# Altium schematic sheet 55. SOC PMIC.SchDoc: PMIC (part 2 of 3)
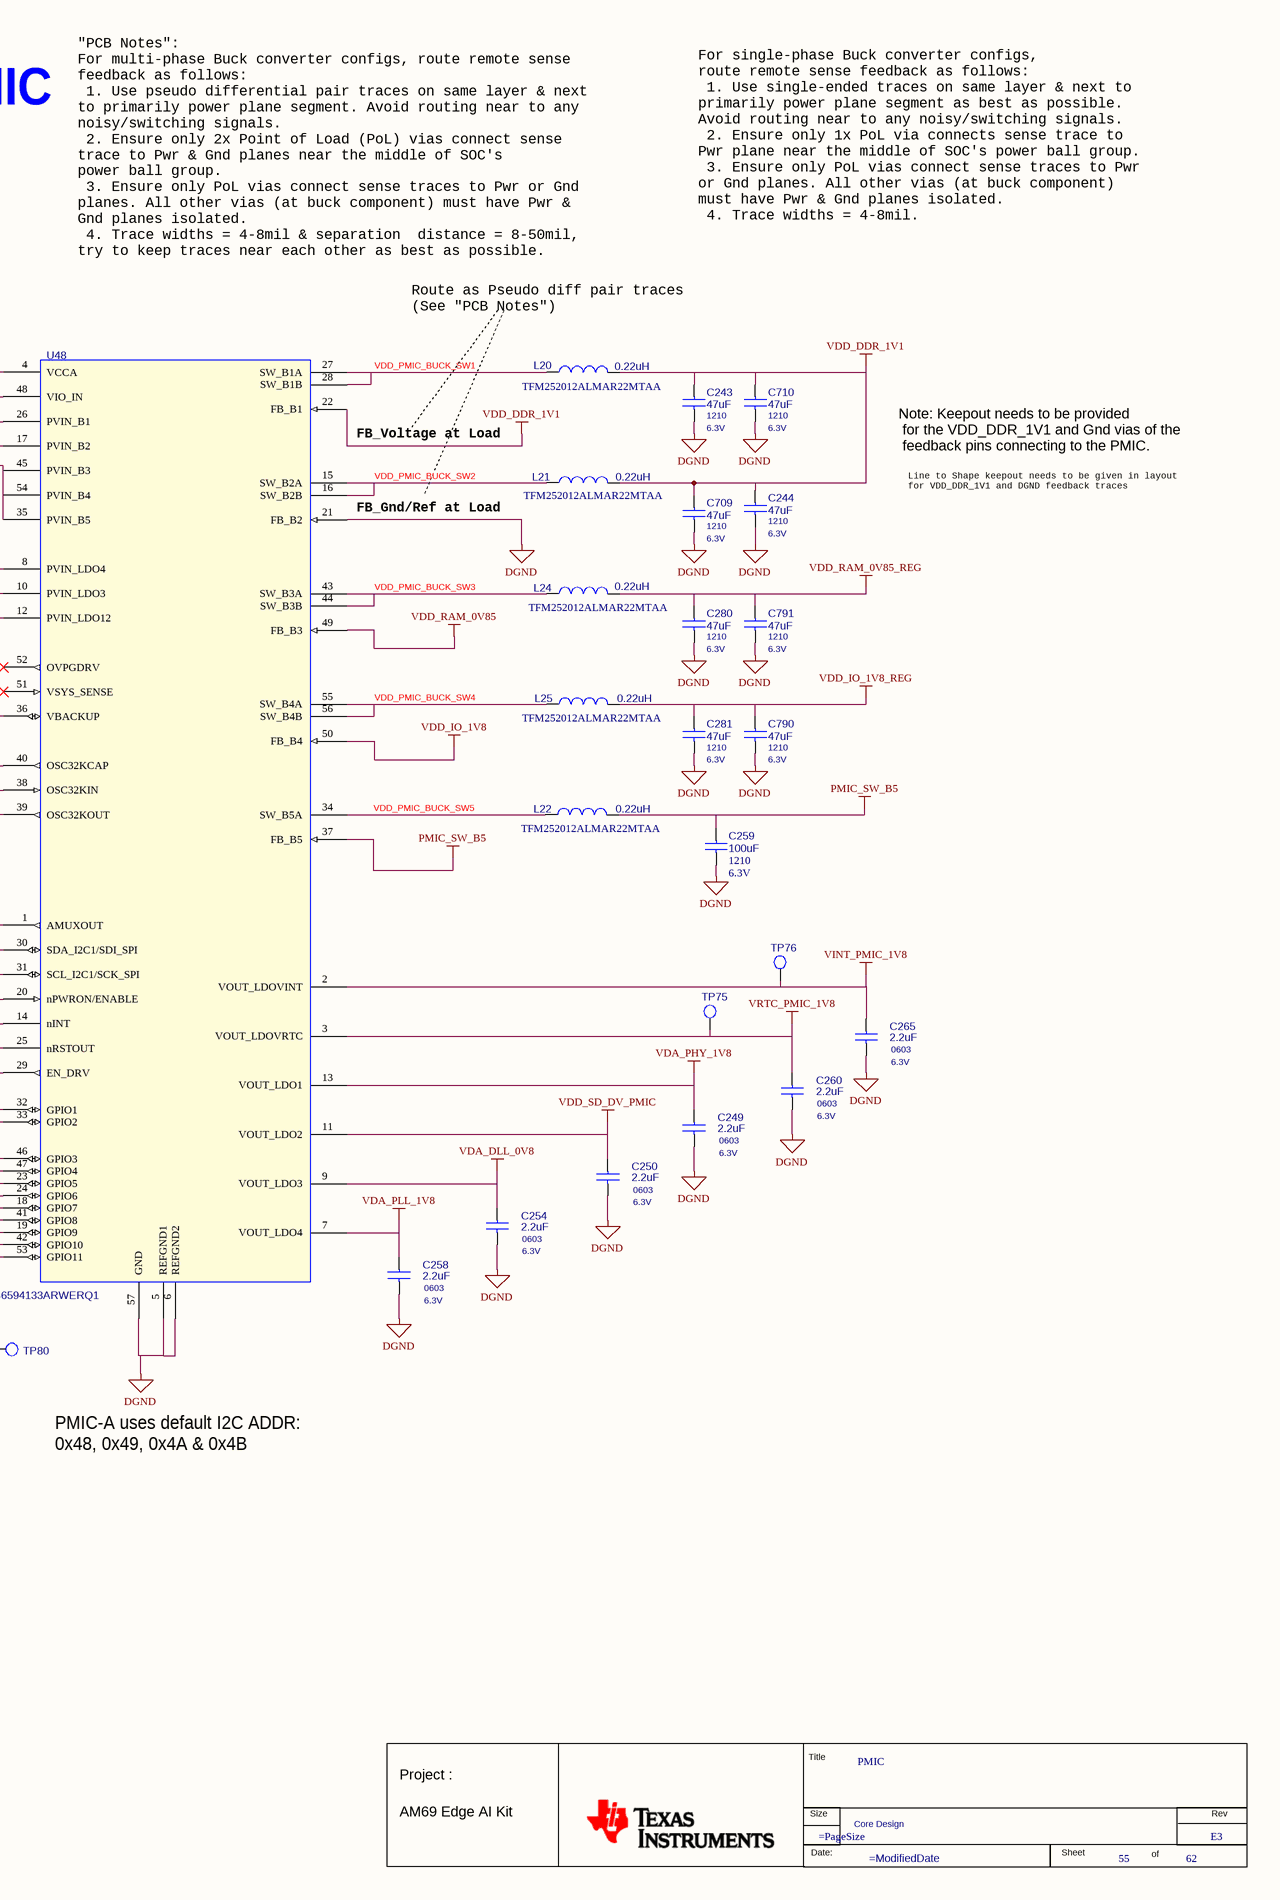
[diagram p2: 55. SOC PMIC.SchDoc, right]
## Library data of the parts
* = MISTRAL_TITLEBLK_CSIZE_1: Issue: 1.0; Project: PROC154E2(001)_SK_AM69; Name: PROC154E2 001 SK AM69; Page Create Date: March  8, 1995; Page Size: =PageSize; Page Modify Date: =ModifiedDate; Schematic Page Count: 62; Schematic Page Number: 55
C243 = CAP_Dup1: CAP CERAMIC 47uF 6.3V 10% X7R AUTO 1210; Part Reference: C243; Automotive Alternate_mfr_part_number: CGA6P1X7S1A476M; Automotive Alternate_mfr_name: TDK; Mistral Part No: 120018090056-R; Mfr_name: MURATA; Mfr_part_number: GCM32ER70J476KE19L; Part_type: CAPACITORS\CERAMIC; Project: TI_J7_SVB-DUT; Wattage: NA; Customs_HS_Code: 85322990; Custom_Duty: 15%; Value: 47uF; PCB Footprint: CAP1210_2-75; Direct Alternate_mfr_part_number: CGA6P1X7S1A476M; Direct Alternate_mfr_name: TDK; Footprint Ref: CAP1210_2-75; Tolerance: 10%; Distributor_name: DIGIKEY; Distributor_part_number: 490-4844-1-ND; Library Ref: CAP; Height: 2.70MM; Weight: 110mg; Temperature: -55°C+125°C; Datasheet: Y:\MIS_DATABASE\DATASHEETS\CAPACITORS\MURATA-GCM-SER.PDF; Crtd /date: ALVY/280918; Chkd/date: MANIRAJA/280918; MECHANICAL 3D STEP FILE: CAP1210_2-75; Library Path: Y:\MIS_DATABASE\Library\ALTIUM_TOOL\SCHEMATICS_PARTS\MS_DISCRETE_Library.schlib; Footprint Path: Y:\MIS_DATABASE\Library\ALTIUM_TOOL\PCB_FOOTPRINTS\Altium_Footprint_Lib.PcbLib; Manufacturer: MURATA
C244 = CAP_Dup1: CAP CERAMIC 47uF 6.3V 10% X7R AUTO 1210; Part Reference: C244; Manufacturer: MURATA; Mistral Part No: 120018090056-R; Mfr_part_number: GCM32ER70J476KE19L; Part_type: CAPACITORS\CERAMIC; Direct Alternate_mfr_name: TDK; Direct Alternate_mfr_part_number: CGA6P1X7S1A476M; Project: TI_J7_SVB-DUT; Wattage: NA; Customs_HS_Code: 85322990; Custom_Duty: 15%; Value: 47uF; PCB Footprint: CAP1210_2-75; Footprint Ref: CAP1210_2-75; Mfr_name: MURATA; Tolerance: 10%; Distributor_name: DIGIKEY; Distributor_part_number: 490-4844-1-ND; Library Ref: CAP; Height: 2.70MM; Weight: 110mg; Temperature: -55°C+125°C; Datasheet: Y:\MIS_DATABASE\DATASHEETS\CAPACITORS\MURATA-GCM-SER.PDF; Crtd /date: ALVY/280918; Chkd/date: MANIRAJA/280918; MECHANICAL 3D STEP FILE: CAP1210_2-75; Library Path: Y:\MIS_DATABASE\Library\ALTIUM_TOOL\SCHEMATICS_PARTS\MS_DISCRETE_Library.schlib; Footprint Path: Y:\MIS_DATABASE\Library\ALTIUM_TOOL\PCB_FOOTPRINTS\Altium_Footprint_Lib.PcbLib; Automotive Alternate_mfr_name: TDK; Automotive Alternate_mfr_part_number: CGA6P1X7S1A476M
C245 = CAP_Dup1: CAP CERAMIC 10uF 16V 10% X5R 0805; Part Reference: C245; Part_type: CAPACITORS\CERAMIC; Mfr_part_number: GRM21BR61C106KE15L; Mfr_name: MURATA; Mistral Part No: 120009030205-R; Direct Alternate_mfr_name: SAMSUNG; Direct Alternate_mfr_part_number: CL21B106KPQNNNE; Automotive Alternate_mfr_part_number: GCM21BR71A106KE22L; Wattage: NA; Custom_Duty: 15%; Customs_HS_Code: 85322990; Project: VOCERA; Value: 10uF; PCB Footprint: CAP0805_1-5; Footprint Path: Y:\MIS_DATABASE\Library\ALTIUM_TOOL\PCB_FOOTPRINTS\Altium_Footprint_Lib.PcbLib; Library Path: Y:\MIS_DATABASE\Library\ALTIUM_TOOL\SCHEMATICS_PARTS\MS_DISCRETE_Library.schlib; MECHANICAL 3D STEP FILE: CAP0805_1-5; Footprint Ref: CAP0805_1-5; Chkd/date: SHREESHAIL/220506; Crtd /date: MAZHAR/150506; Datasheet: Y:\MIS_DATABASE\DATASHEETS\CAPACITORS\MURATA-GXX-SER_NOV17.PDF; Temperature: -55°C+85°C; Weight: 9.5mg; Height: 1.35MM; Library Ref: CAP; Distributor_part_number: 490-3886-1-ND; Distributor_name: DIGIKEY; Tolerance: 10%; Automotive Alternate_mfr_name: MURATA; Manufacturer: MURATA
C246 = CAP_Dup1: CAP CERAMIC 10uF 16V 10% X5R 0805; Part Reference: C246; Manufacturer: MURATA; Automotive Alternate_mfr_part_number: GCM21BR71A106KE22L; Direct Alternate_mfr_part_number: CL21B106KPQNNNE; Direct Alternate_mfr_name: SAMSUNG; Part_type: CAPACITORS\CERAMIC; Mfr_part_number: GRM21BR61C106KE15L; Mistral Part No: 120009030205-R; Custom_Duty: 15%; Customs_HS_Code: 85322990; Project: VOCERA; Wattage: NA; Value: 10uF; PCB Footprint: CAP0805_1-5; Automotive Alternate_mfr_name: MURATA; Chkd/date: SHREESHAIL/220506; Crtd /date: MAZHAR/150506; Datasheet: Y:\MIS_DATABASE\DATASHEETS\CAPACITORS\MURATA-GXX-SER_NOV17.PDF; Temperature: -55°C+85°C; Weight: 9.5mg; Height: 1.35MM; Library Ref: CAP; Distributor_part_number: 490-3886-1-ND; Distributor_name: DIGIKEY; Tolerance: 10%; Mfr_name: MURATA; Footprint Ref: CAP0805_1-5; MECHANICAL 3D STEP FILE: CAP0805_1-5; Library Path: Y:\MIS_DATABASE\Library\ALTIUM_TOOL\SCHEMATICS_PARTS\MS_DISCRETE_Library.schlib; Footprint Path: Y:\MIS_DATABASE\Library\ALTIUM_TOOL\PCB_FOOTPRINTS\Altium_Footprint_Lib.PcbLib
C249 = CAP_Dup1: CAP CERAMIC 2.2uF 6.3V 10% X7R AUTO 0603; Part Reference: C249; Part_type: CAPACITORS\CERAMIC; Mfr_part_number: GCM188R70J225KE22D; Mfr_name: MURATA; Mistral Part No: 120019040009-R; Direct Alternate_mfr_name: TDK; Direct Alternate_mfr_part_number: CGA3E1X7R0J225K080AC; Custom_Duty: 15%; Customs_HS_Code: 85322990; Wattage: NA; Project: J7ES_SOM_DUAL-LEO_PMIC; Value: 2.2uF; Footprint Path: Y:\MIS_DATABASE\Library\ALTIUM_TOOL\PCB_FOOTPRINTS\Altium_Footprint_Lib.PcbLib; Library Path: Y:\MIS_DATABASE\Library\ALTIUM_TOOL\SCHEMATICS_PARTS\MS_DISCRETE_Library.schlib; MECHANICAL 3D STEP FILE: CAP0603_1; Chkd/date: MANIRAJA/050419; Crtd /date: ALVY/050419; Datasheet: Y:\MIS_DATABASE\DATASHEETS\CAPACITORS\GCM188R70J225KE22.PDF; Temperature: -55°C+125°C; Weight: 6.3mg; Height: 0.90MM; Library Ref: CAP; Distributor_part_number: 490-5316-1-ND; Distributor_name: DIGIKEY; Tolerance: 10%; Footprint Ref: CAP0603_1; Automotive Alternate_mfr_name: TDK; Automotive Alternate_mfr_part_number: CGA3E1X7R0J225K080AC; PCB Footprint: CAP0603_1; Manufacturer: MURATA
C250 = CAP_Dup1: CAP CERAMIC 2.2uF 6.3V 10% X7R AUTO 0603; Part Reference: C250; Part_type: CAPACITORS\CERAMIC; Mfr_part_number: GCM188R70J225KE22D; Mfr_name: MURATA; Mistral Part No: 120019040009-R; Direct Alternate_mfr_name: TDK; Direct Alternate_mfr_part_number: CGA3E1X7R0J225K080AC; Custom_Duty: 15%; Customs_HS_Code: 85322990; Wattage: NA; Project: J7ES_SOM_DUAL-LEO_PMIC; Value: 2.2uF; PCB Footprint: CAP0603_1; Footprint Path: Y:\MIS_DATABASE\Library\ALTIUM_TOOL\PCB_FOOTPRINTS\Altium_Footprint_Lib.PcbLib; Library Path: Y:\MIS_DATABASE\Library\ALTIUM_TOOL\SCHEMATICS_PARTS\MS_DISCRETE_Library.schlib; MECHANICAL 3D STEP FILE: CAP0603_1; Chkd/date: MANIRAJA/050419; Crtd /date: ALVY/050419; Datasheet: Y:\MIS_DATABASE\DATASHEETS\CAPACITORS\GCM188R70J225KE22.PDF; Temperature: -55°C+125°C; Weight: 6.3mg; Height: 0.90MM; Library Ref: CAP; Distributor_part_number: 490-5316-1-ND; Distributor_name: DIGIKEY; Tolerance: 10%; Footprint Ref: CAP0603_1; Automotive Alternate_mfr_name: TDK; Automotive Alternate_mfr_part_number: CGA3E1X7R0J225K080AC; Manufacturer: MURATA
C254 = CAP_Dup1: CAP CERAMIC 2.2uF 6.3V 10% X7R AUTO 0603; Part Reference: C254; Part_type: CAPACITORS\CERAMIC; Mfr_part_number: GCM188R70J225KE22D; Mfr_name: MURATA; Mistral Part No: 120019040009-R; Direct Alternate_mfr_name: TDK; Direct Alternate_mfr_part_number: CGA3E1X7R0J225K080AC; Custom_Duty: 15%; Customs_HS_Code: 85322990; Wattage: NA; Project: J7ES_SOM_DUAL-LEO_PMIC; Value: 2.2uF; Footprint Path: Y:\MIS_DATABASE\Library\ALTIUM_TOOL\PCB_FOOTPRINTS\Altium_Footprint_Lib.PcbLib; Library Path: Y:\MIS_DATABASE\Library\ALTIUM_TOOL\SCHEMATICS_PARTS\MS_DISCRETE_Library.schlib; MECHANICAL 3D STEP FILE: CAP0603_1; Chkd/date: MANIRAJA/050419; Crtd /date: ALVY/050419; Datasheet: Y:\MIS_DATABASE\DATASHEETS\CAPACITORS\GCM188R70J225KE22.PDF; Temperature: -55°C+125°C; Weight: 6.3mg; Height: 0.90MM; Library Ref: CAP; Distributor_part_number: 490-5316-1-ND; Distributor_name: DIGIKEY; Tolerance: 10%; Footprint Ref: CAP0603_1; Automotive Alternate_mfr_name: TDK; Automotive Alternate_mfr_part_number: CGA3E1X7R0J225K080AC; PCB Footprint: CAP0603_1; Manufacturer: MURATA
C257 = CAP_Dup1: CAP CERAMIC 10uF 16V 10% X5R 0805; Part Reference: C257; Manufacturer: MURATA; Automotive Alternate_mfr_part_number: GCM21BR71A106KE22L; Direct Alternate_mfr_part_number: CL21B106KPQNNNE; Direct Alternate_mfr_name: SAMSUNG; Part_type: CAPACITORS\CERAMIC; Mfr_part_number: GRM21BR61C106KE15L; Mistral Part No: 120009030205-R; Custom_Duty: 15%; Customs_HS_Code: 85322990; Project: VOCERA; Wattage: NA; Value: 10uF; PCB Footprint: CAP0805_1-5; Automotive Alternate_mfr_name: MURATA; Chkd/date: SHREESHAIL/220506; Crtd /date: MAZHAR/150506; Datasheet: Y:\MIS_DATABASE\DATASHEETS\CAPACITORS\MURATA-GXX-SER_NOV17.PDF; Temperature: -55°C+85°C; Weight: 9.5mg; Height: 1.35MM; Library Ref: CAP; Distributor_part_number: 490-3886-1-ND; Distributor_name: DIGIKEY; Tolerance: 10%; Mfr_name: MURATA; Footprint Ref: CAP0805_1-5; MECHANICAL 3D STEP FILE: CAP0805_1-5; Library Path: Y:\MIS_DATABASE\Library\ALTIUM_TOOL\SCHEMATICS_PARTS\MS_DISCRETE_Library.schlib; Footprint Path: Y:\MIS_DATABASE\Library\ALTIUM_TOOL\PCB_FOOTPRINTS\Altium_Footprint_Lib.PcbLib
C258 = CAP_Dup1: CAP CERAMIC 2.2uF 6.3V 10% X7R AUTO 0603; Part Reference: C258; Part_type: CAPACITORS\CERAMIC; Mfr_part_number: GCM188R70J225KE22D; Mfr_name: MURATA; Mistral Part No: 120019040009-R; Direct Alternate_mfr_name: TDK; Direct Alternate_mfr_part_number: CGA3E1X7R0J225K080AC; Custom_Duty: 15%; Customs_HS_Code: 85322990; Wattage: NA; Project: J7ES_SOM_DUAL-LEO_PMIC; Value: 2.2uF; Footprint Path: Y:\MIS_DATABASE\Library\ALTIUM_TOOL\PCB_FOOTPRINTS\Altium_Footprint_Lib.PcbLib; Library Path: Y:\MIS_DATABASE\Library\ALTIUM_TOOL\SCHEMATICS_PARTS\MS_DISCRETE_Library.schlib; MECHANICAL 3D STEP FILE: CAP0603_1; Chkd/date: MANIRAJA/050419; Crtd /date: ALVY/050419; Datasheet: Y:\MIS_DATABASE\DATASHEETS\CAPACITORS\GCM188R70J225KE22.PDF; Temperature: -55°C+125°C; Weight: 6.3mg; Height: 0.90MM; Library Ref: CAP; Distributor_part_number: 490-5316-1-ND; Distributor_name: DIGIKEY; Tolerance: 10%; Footprint Ref: CAP0603_1; Automotive Alternate_mfr_name: TDK; Automotive Alternate_mfr_part_number: CGA3E1X7R0J225K080AC; PCB Footprint: CAP0603_1; Manufacturer: MURATA
C259 = CAP_Dup1: CAP CERAMIC 100uF 2.5V 20% X7T 1210; Part Reference: C259; Automotive Alternate_mfr_part_number: CGA6P1X7S1A476M; Automotive Alternate_mfr_name: TDK; Part_type: CAPACITORS\CERAMIC; Mfr_part_number: GCM32ED70E107ME36; Mfr_name: MURATA; Mistral Part No: 120009080004-R; Custom_Duty: 15%; Customs_HS_Code: 85322990; Wattage: NA; Project: ALL_DATA_NANO_SOM; Value: 100uF; Direct Alternate_mfr_part_number: CGA6P1X7S1A476M; Direct Alternate_mfr_name: TDK; Footprint Path: Y:\MIS_DATABASE\Library\ALTIUM_TOOL\PCB_FOOTPRINTS\Altium_Footprint_Lib.PcbLib; Library Path: Y:\MIS_DATABASE\Library\ALTIUM_TOOL\SCHEMATICS_PARTS\MS_DISCRETE_Library.schlib; MECHANICAL 3D STEP FILE: CAP1210_2-75; Chkd/date: VASANTHA/291216; Crtd /date: MANIRAJA/291216; Datasheet: Y:\MIS_DATABASE\DATASHEETS\CAPACITORS\MURATA-GXX-SER_NOV17.PDF; Temperature: -55°C+85°C; Weight: 110mg; Height: 2.70MM; Library Ref: CAP; Distributor_part_number: 490-3390-1-ND; Distributor_name: DIGIKEY; Tolerance: 20%; Footprint Ref: CAP1210_2-75; Manufacturer: MURATA; PCB Footprint: CAP1210_2-75
C260 = CAP_Dup1: CAP CERAMIC 2.2uF 6.3V 10% X7R AUTO 0603; Part Reference: C260; Part_type: CAPACITORS\CERAMIC; Mfr_part_number: GCM188R70J225KE22D; Mfr_name: MURATA; Mistral Part No: 120019040009-R; Direct Alternate_mfr_name: TDK; Direct Alternate_mfr_part_number: CGA3E1X7R0J225K080AC; Custom_Duty: 15%; Customs_HS_Code: 85322990; Wattage: NA; Project: J7ES_SOM_DUAL-LEO_PMIC; Value: 2.2uF; PCB Footprint: CAP0603_1; Footprint Path: Y:\MIS_DATABASE\Library\ALTIUM_TOOL\PCB_FOOTPRINTS\Altium_Footprint_Lib.PcbLib; Library Path: Y:\MIS_DATABASE\Library\ALTIUM_TOOL\SCHEMATICS_PARTS\MS_DISCRETE_Library.schlib; MECHANICAL 3D STEP FILE: CAP0603_1; Chkd/date: MANIRAJA/050419; Crtd /date: ALVY/050419; Datasheet: Y:\MIS_DATABASE\DATASHEETS\CAPACITORS\GCM188R70J225KE22.PDF; Temperature: -55°C+125°C; Weight: 6.3mg; Height: 0.90MM; Library Ref: CAP; Distributor_part_number: 490-5316-1-ND; Distributor_name: DIGIKEY; Tolerance: 10%; Footprint Ref: CAP0603_1; Automotive Alternate_mfr_name: TDK; Automotive Alternate_mfr_part_number: CGA3E1X7R0J225K080AC; Manufacturer: MURATA
C265 = CAP_Dup1: CAP CERAMIC 2.2uF 6.3V 10% X7R AUTO 0603; Part Reference: C265; Manufacturer: MURATA; Automotive Alternate_mfr_part_number: CGA3E1X7R0J225K080AC; Automotive Alternate_mfr_name: TDK; Part_type: CAPACITORS\CERAMIC; Mfr_part_number: GCM188R70J225KE22D; Mistral Part No: 120019040009-R; Custom_Duty: 15%; Customs_HS_Code: 85322990; Wattage: NA; Project: J7ES_SOM_DUAL-LEO_PMIC; Value: 2.2uF; PCB Footprint: CAP0603_1; Direct Alternate_mfr_part_number: CGA3E1X7R0J225K080AC; Direct Alternate_mfr_name: TDK; Footprint Path: Y:\MIS_DATABASE\Library\ALTIUM_TOOL\PCB_FOOTPRINTS\Altium_Footprint_Lib.PcbLib; Library Path: Y:\MIS_DATABASE\Library\ALTIUM_TOOL\SCHEMATICS_PARTS\MS_DISCRETE_Library.schlib; MECHANICAL 3D STEP FILE: CAP0603_1; Chkd/date: MANIRAJA/050419; Crtd /date: ALVY/050419; Datasheet: Y:\MIS_DATABASE\DATASHEETS\CAPACITORS\GCM188R70J225KE22.PDF; Temperature: -55°C+125°C; Weight: 6.3mg; Height: 0.90MM; Library Ref: CAP; Distributor_part_number: 490-5316-1-ND; Distributor_name: DIGIKEY; Tolerance: 10%; Mfr_name: MURATA; Footprint Ref: CAP0603_1
C275 = CAP_Dup1: CAP CERAMIC 10uF 16V 10% X5R 0805; Part Reference: C275; Part_type: CAPACITORS\CERAMIC; Mfr_part_number: GRM21BR61C106KE15L; Mfr_name: MURATA; Mistral Part No: 120009030205-R; Direct Alternate_mfr_name: SAMSUNG; Direct Alternate_mfr_part_number: CL21B106KPQNNNE; Automotive Alternate_mfr_part_number: GCM21BR71A106KE22L; Wattage: NA; Custom_Duty: 15%; Customs_HS_Code: 85322990; Project: VOCERA; Value: 10uF; PCB Footprint: CAP0805_1-5; Footprint Path: Y:\MIS_DATABASE\Library\ALTIUM_TOOL\PCB_FOOTPRINTS\Altium_Footprint_Lib.PcbLib; Library Path: Y:\MIS_DATABASE\Library\ALTIUM_TOOL\SCHEMATICS_PARTS\MS_DISCRETE_Library.schlib; MECHANICAL 3D STEP FILE: CAP0805_1-5; Footprint Ref: CAP0805_1-5; Chkd/date: SHREESHAIL/220506; Crtd /date: MAZHAR/150506; Datasheet: Y:\MIS_DATABASE\DATASHEETS\CAPACITORS\MURATA-GXX-SER_NOV17.PDF; Temperature: -55°C+85°C; Weight: 9.5mg; Height: 1.35MM; Library Ref: CAP; Distributor_part_number: 490-3886-1-ND; Distributor_name: DIGIKEY; Tolerance: 10%; Automotive Alternate_mfr_name: MURATA; Manufacturer: MURATA
C276 = CAP_Dup1: CAP CERAMIC 10uF 16V 10% X5R 0805; Part Reference: C276; Mistral Part No: 120009030205-R; Mfr_name: MURATA; Mfr_part_number: GRM21BR61C106KE15L; Part_type: CAPACITORS\CERAMIC; Direct Alternate_mfr_name: SAMSUNG; Direct Alternate_mfr_part_number: CL21B106KPQNNNE; Automotive Alternate_mfr_part_number: GCM21BR71A106KE22L; Wattage: NA; Project: VOCERA; Customs_HS_Code: 85322990; Custom_Duty: 15%; Value: 10uF; PCB Footprint: CAP0805_1-5; Footprint Path: Y:\MIS_DATABASE\Library\ALTIUM_TOOL\PCB_FOOTPRINTS\Altium_Footprint_Lib.PcbLib; Library Path: Y:\MIS_DATABASE\Library\ALTIUM_TOOL\SCHEMATICS_PARTS\MS_DISCRETE_Library.schlib; MECHANICAL 3D STEP FILE: CAP0805_1-5; Footprint Ref: CAP0805_1-5; Tolerance: 10%; Distributor_name: DIGIKEY; Distributor_part_number: 490-3886-1-ND; Library Ref: CAP; Height: 1.35MM; Weight: 9.5mg; Temperature: -55°C+85°C; Datasheet: Y:\MIS_DATABASE\DATASHEETS\CAPACITORS\MURATA-GXX-SER_NOV17.PDF; Crtd /date: MAZHAR/150506; Chkd/date: SHREESHAIL/220506; Automotive Alternate_mfr_name: MURATA; Manufacturer: MURATA
C280 = CAP_Dup1: CAP CERAMIC 47uF 6.3V 10% X7R AUTO 1210; Part Reference: C280; Mistral Part No: 120018090056-R; Mfr_name: MURATA; Mfr_part_number: GCM32ER70J476KE19L; Part_type: CAPACITORS\CERAMIC; Direct Alternate_mfr_name: TDK; Direct Alternate_mfr_part_number: CGA6P1X7S1A476M; Project: TI_J7_SVB-DUT; Wattage: NA; Customs_HS_Code: 85322990; Custom_Duty: 15%; Value: 47uF; Footprint Ref: CAP1210_2-75; Tolerance: 10%; Distributor_name: DIGIKEY; Distributor_part_number: 490-4844-1-ND; Library Ref: CAP; Height: 2.70MM; Weight: 110mg; Temperature: -55°C+125°C; Datasheet: Y:\MIS_DATABASE\DATASHEETS\CAPACITORS\MURATA-GCM-SER.PDF; Crtd /date: ALVY/280918; Chkd/date: MANIRAJA/280918; MECHANICAL 3D STEP FILE: CAP1210_2-75; Library Path: Y:\MIS_DATABASE\Library\ALTIUM_TOOL\SCHEMATICS_PARTS\MS_DISCRETE_Library.schlib; Footprint Path: Y:\MIS_DATABASE\Library\ALTIUM_TOOL\PCB_FOOTPRINTS\Altium_Footprint_Lib.PcbLib; Automotive Alternate_mfr_name: TDK; Automotive Alternate_mfr_part_number: CGA6P1X7S1A476M; PCB Footprint: CAP1210_2-75; Manufacturer: MURATA
C281 = CAP_Dup1: CAP CERAMIC 47uF 6.3V 10% X7R AUTO 1210; Part Reference: C281; Mistral Part No: 120018090056-R; Mfr_name: MURATA; Mfr_part_number: GCM32ER70J476KE19L; Part_type: CAPACITORS\CERAMIC; Direct Alternate_mfr_name: TDK; Direct Alternate_mfr_part_number: CGA6P1X7S1A476M; Project: TI_J7_SVB-DUT; Wattage: NA; Customs_HS_Code: 85322990; Custom_Duty: 15%; Value: 47uF; Footprint Ref: CAP1210_2-75; Tolerance: 10%; Distributor_name: DIGIKEY; Distributor_part_number: 490-4844-1-ND; Library Ref: CAP; Height: 2.70MM; Weight: 110mg; Temperature: -55°C+125°C; Datasheet: Y:\MIS_DATABASE\DATASHEETS\CAPACITORS\MURATA-GCM-SER.PDF; Crtd /date: ALVY/280918; Chkd/date: MANIRAJA/280918; MECHANICAL 3D STEP FILE: CAP1210_2-75; Library Path: Y:\MIS_DATABASE\Library\ALTIUM_TOOL\SCHEMATICS_PARTS\MS_DISCRETE_Library.schlib; Footprint Path: Y:\MIS_DATABASE\Library\ALTIUM_TOOL\PCB_FOOTPRINTS\Altium_Footprint_Lib.PcbLib; Automotive Alternate_mfr_name: TDK; Automotive Alternate_mfr_part_number: CGA6P1X7S1A476M; PCB Footprint: CAP1210_2-75; Manufacturer: MURATA
C709 = CAP_Dup1: CAP CERAMIC 47uF 6.3V 10% X7R AUTO 1210; Part Reference: C709; Automotive Alternate_mfr_part_number: CGA6P1X7S1A476M; Automotive Alternate_mfr_name: TDK; Part_type: CAPACITORS\CERAMIC; Mfr_part_number: GCM32ER70J476KE19L; Mfr_name: MURATA; Mistral Part No: 120018090056-R; Custom_Duty: 15%; Customs_HS_Code: 85322990; Wattage: NA; Project: TI_J7_SVB-DUT; Value: 47uF; Direct Alternate_mfr_part_number: CGA6P1X7S1A476M; Direct Alternate_mfr_name: TDK; Footprint Path: Y:\MIS_DATABASE\Library\ALTIUM_TOOL\PCB_FOOTPRINTS\Altium_Footprint_Lib.PcbLib; Library Path: Y:\MIS_DATABASE\Library\ALTIUM_TOOL\SCHEMATICS_PARTS\MS_DISCRETE_Library.schlib; MECHANICAL 3D STEP FILE: CAP1210_2-75; Chkd/date: MANIRAJA/280918; Crtd /date: ALVY/280918; Datasheet: Y:\MIS_DATABASE\DATASHEETS\CAPACITORS\MURATA-GCM-SER.PDF; Temperature: -55°C+125°C; Weight: 110mg; Height: 2.70MM; Library Ref: CAP; Distributor_part_number: 490-4844-1-ND; Distributor_name: DIGIKEY; Tolerance: 10%; Footprint Ref: CAP1210_2-75; PCB Footprint: CAP1210_2-75; Manufacturer: MURATA
C710 = CAP_Dup1: CAP CERAMIC 47uF 6.3V 10% X7R AUTO 1210; Part Reference: C710; Automotive Alternate_mfr_part_number: CGA6P1X7S1A476M; Automotive Alternate_mfr_name: TDK; Mistral Part No: 120018090056-R; Mfr_name: MURATA; Mfr_part_number: GCM32ER70J476KE19L; Part_type: CAPACITORS\CERAMIC; Project: TI_J7_SVB-DUT; Wattage: NA; Customs_HS_Code: 85322990; Custom_Duty: 15%; Value: 47uF; Direct Alternate_mfr_part_number: CGA6P1X7S1A476M; Direct Alternate_mfr_name: TDK; Footprint Ref: CAP1210_2-75; Tolerance: 10%; Distributor_name: DIGIKEY; Distributor_part_number: 490-4844-1-ND; Library Ref: CAP; Height: 2.70MM; Weight: 110mg; Temperature: -55°C+125°C; Datasheet: Y:\MIS_DATABASE\DATASHEETS\CAPACITORS\MURATA-GCM-SER.PDF; Crtd /date: ALVY/280918; Chkd/date: MANIRAJA/280918; MECHANICAL 3D STEP FILE: CAP1210_2-75; Library Path: Y:\MIS_DATABASE\Library\ALTIUM_TOOL\SCHEMATICS_PARTS\MS_DISCRETE_Library.schlib; Footprint Path: Y:\MIS_DATABASE\Library\ALTIUM_TOOL\PCB_FOOTPRINTS\Altium_Footprint_Lib.PcbLib; PCB Footprint: CAP1210_2-75; Manufacturer: MURATA
C727 = CAP_Dup1: CAP CERAMIC 10uF 16V 10% X5R 0805; Part Reference: C727; Mistral Part No: 120009030205-R; Mfr_name: MURATA; Mfr_part_number: GRM21BR61C106KE15L; Part_type: CAPACITORS\CERAMIC; Direct Alternate_mfr_name: SAMSUNG; Direct Alternate_mfr_part_number: CL21B106KPQNNNE; Automotive Alternate_mfr_part_number: GCM21BR71A106KE22L; Wattage: NA; Project: VOCERA; Customs_HS_Code: 85322990; Custom_Duty: 15%; Value: 10uF; PCB Footprint: CAP0805_1-5; Footprint Path: Y:\MIS_DATABASE\Library\ALTIUM_TOOL\PCB_FOOTPRINTS\Altium_Footprint_Lib.PcbLib; Library Path: Y:\MIS_DATABASE\Library\ALTIUM_TOOL\SCHEMATICS_PARTS\MS_DISCRETE_Library.schlib; MECHANICAL 3D STEP FILE: CAP0805_1-5; Footprint Ref: CAP0805_1-5; Tolerance: 10%; Distributor_name: DIGIKEY; Distributor_part_number: 490-3886-1-ND; Library Ref: CAP; Height: 1.35MM; Weight: 9.5mg; Temperature: -55°C+85°C; Datasheet: Y:\MIS_DATABASE\DATASHEETS\CAPACITORS\MURATA-GXX-SER_NOV17.PDF; Crtd /date: MAZHAR/150506; Chkd/date: SHREESHAIL/220506; Automotive Alternate_mfr_name: MURATA; Manufacturer: MURATA
C728 = CAP_Dup1: CAP CERAMIC 10uF 16V 10% X5R 0805; Part Reference: C728; Manufacturer: MURATA; Automotive Alternate_mfr_part_number: GCM21BR71A106KE22L; Direct Alternate_mfr_part_number: CL21B106KPQNNNE; Direct Alternate_mfr_name: SAMSUNG; Part_type: CAPACITORS\CERAMIC; Mfr_part_number: GRM21BR61C106KE15L; Mistral Part No: 120009030205-R; Custom_Duty: 15%; Customs_HS_Code: 85322990; Project: VOCERA; Wattage: NA; Value: 10uF; PCB Footprint: CAP0805_1-5; Automotive Alternate_mfr_name: MURATA; Chkd/date: SHREESHAIL/220506; Crtd /date: MAZHAR/150506; Datasheet: Y:\MIS_DATABASE\DATASHEETS\CAPACITORS\MURATA-GXX-SER_NOV17.PDF; Temperature: -55°C+85°C; Weight: 9.5mg; Height: 1.35MM; Library Ref: CAP; Distributor_part_number: 490-3886-1-ND; Distributor_name: DIGIKEY; Tolerance: 10%; Mfr_name: MURATA; Footprint Ref: CAP0805_1-5; MECHANICAL 3D STEP FILE: CAP0805_1-5; Library Path: Y:\MIS_DATABASE\Library\ALTIUM_TOOL\SCHEMATICS_PARTS\MS_DISCRETE_Library.schlib; Footprint Path: Y:\MIS_DATABASE\Library\ALTIUM_TOOL\PCB_FOOTPRINTS\Altium_Footprint_Lib.PcbLib
C741 = CAP_Dup1: CAP CERAMIC 2.2uF 6.3V 10% X7R AUTO 0603; Part Reference: C741; Part_type: CAPACITORS\CERAMIC; Mfr_part_number: GCM188R70J225KE22D; Mfr_name: MURATA; Mistral Part No: 120019040009-R; Direct Alternate_mfr_name: TDK; Direct Alternate_mfr_part_number: CGA3E1X7R0J225K080AC; Custom_Duty: 15%; Customs_HS_Code: 85322990; Wattage: NA; Project: J7ES_SOM_DUAL-LEO_PMIC; Value: 2.2uF; Footprint Path: Y:\MIS_DATABASE\Library\ALTIUM_TOOL\PCB_FOOTPRINTS\Altium_Footprint_Lib.PcbLib; Library Path: Y:\MIS_DATABASE\Library\ALTIUM_TOOL\SCHEMATICS_PARTS\MS_DISCRETE_Library.schlib; MECHANICAL 3D STEP FILE: CAP0603_1; Chkd/date: MANIRAJA/050419; Crtd /date: ALVY/050419; Datasheet: Y:\MIS_DATABASE\DATASHEETS\CAPACITORS\GCM188R70J225KE22.PDF; Temperature: -55°C+125°C; Weight: 6.3mg; Height: 0.90MM; Library Ref: CAP; Distributor_part_number: 490-5316-1-ND; Distributor_name: DIGIKEY; Tolerance: 10%; Footprint Ref: CAP0603_1; Automotive Alternate_mfr_name: TDK; Automotive Alternate_mfr_part_number: CGA3E1X7R0J225K080AC; PCB Footprint: CAP0603_1; Manufacturer: MURATA
C751 = CAP_Dup1: CAP CERAMIC 2.2uF 6.3V 10% X7R AUTO 0603; Part Reference: C751; Mistral Part No: 120019040009-R; Mfr_name: MURATA; Mfr_part_number: GCM188R70J225KE22D; Part_type: CAPACITORS\CERAMIC; Direct Alternate_mfr_name: TDK; Direct Alternate_mfr_part_number: CGA3E1X7R0J225K080AC; Project: J7ES_SOM_DUAL-LEO_PMIC; Wattage: NA; Customs_HS_Code: 85322990; Custom_Duty: 15%; Value: 2.2uF; Footprint Ref: CAP0603_1; Tolerance: 10%; Distributor_name: DIGIKEY; Distributor_part_number: 490-5316-1-ND; Library Ref: CAP; Height: 0.90MM; Weight: 6.3mg; Temperature: -55°C+125°C; Datasheet: Y:\MIS_DATABASE\DATASHEETS\CAPACITORS\GCM188R70J225KE22.PDF; Crtd /date: ALVY/050419; Chkd/date: MANIRAJA/050419; MECHANICAL 3D STEP FILE: CAP0603_1; Library Path: Y:\MIS_DATABASE\Library\ALTIUM_TOOL\SCHEMATICS_PARTS\MS_DISCRETE_Library.schlib; Footprint Path: Y:\MIS_DATABASE\Library\ALTIUM_TOOL\PCB_FOOTPRINTS\Altium_Footprint_Lib.PcbLib; Automotive Alternate_mfr_name: TDK; Automotive Alternate_mfr_part_number: CGA3E1X7R0J225K080AC; PCB Footprint: CAP0603_1; Manufacturer: MURATA
C763 = CAP_Dup1: CAP CERAMIC 2.2uF 6.3V 10% X7R AUTO 0603; Part Reference: C763; Mistral Part No: 120019040009-R; Mfr_name: MURATA; Mfr_part_number: GCM188R70J225KE22D; Part_type: CAPACITORS\CERAMIC; Direct Alternate_mfr_name: TDK; Direct Alternate_mfr_part_number: CGA3E1X7R0J225K080AC; Project: J7ES_SOM_DUAL-LEO_PMIC; Wattage: NA; Customs_HS_Code: 85322990; Custom_Duty: 15%; Value: 2.2uF; Footprint Ref: CAP0603_1; Tolerance: 10%; Distributor_name: DIGIKEY; Distributor_part_number: 490-5316-1-ND; Library Ref: CAP; Height: 0.90MM; Weight: 6.3mg; Temperature: -55°C+125°C; Datasheet: Y:\MIS_DATABASE\DATASHEETS\CAPACITORS\GCM188R70J225KE22.PDF; Crtd /date: ALVY/050419; Chkd/date: MANIRAJA/050419; MECHANICAL 3D STEP FILE: CAP0603_1; Library Path: Y:\MIS_DATABASE\Library\ALTIUM_TOOL\SCHEMATICS_PARTS\MS_DISCRETE_Library.schlib; Footprint Path: Y:\MIS_DATABASE\Library\ALTIUM_TOOL\PCB_FOOTPRINTS\Altium_Footprint_Lib.PcbLib; Automotive Alternate_mfr_name: TDK; Automotive Alternate_mfr_part_number: CGA3E1X7R0J225K080AC; PCB Footprint: CAP0603_1; Manufacturer: MURATA
C764 = CAP_Dup1: CAP CERAMIC 2.2uF 6.3V 10% X7R AUTO 0603; Part Reference: C764; Part_type: CAPACITORS\CERAMIC; Mfr_part_number: GCM188R70J225KE22D; Mfr_name: MURATA; Mistral Part No: 120019040009-R; Direct Alternate_mfr_name: TDK; Direct Alternate_mfr_part_number: CGA3E1X7R0J225K080AC; Custom_Duty: 15%; Customs_HS_Code: 85322990; Wattage: NA; Project: J7ES_SOM_DUAL-LEO_PMIC; Value: 2.2uF; Footprint Path: Y:\MIS_DATABASE\Library\ALTIUM_TOOL\PCB_FOOTPRINTS\Altium_Footprint_Lib.PcbLib; Library Path: Y:\MIS_DATABASE\Library\ALTIUM_TOOL\SCHEMATICS_PARTS\MS_DISCRETE_Library.schlib; MECHANICAL 3D STEP FILE: CAP0603_1; Chkd/date: MANIRAJA/050419; Crtd /date: ALVY/050419; Datasheet: Y:\MIS_DATABASE\DATASHEETS\CAPACITORS\GCM188R70J225KE22.PDF; Temperature: -55°C+125°C; Weight: 6.3mg; Height: 0.90MM; Library Ref: CAP; Distributor_part_number: 490-5316-1-ND; Distributor_name: DIGIKEY; Tolerance: 10%; Footprint Ref: CAP0603_1; Automotive Alternate_mfr_name: TDK; Automotive Alternate_mfr_part_number: CGA3E1X7R0J225K080AC; PCB Footprint: CAP0603_1; Manufacturer: MURATA
C767 = CAP_Dup1: CAP CERAMIC 10uF 16V 10% X5R 0805; Part Reference: C767; Mistral Part No: 120009030205-R; Mfr_name: MURATA; Mfr_part_number: GRM21BR61C106KE15L; Part_type: CAPACITORS\CERAMIC; Direct Alternate_mfr_name: SAMSUNG; Direct Alternate_mfr_part_number: CL21B106KPQNNNE; Automotive Alternate_mfr_part_number: GCM21BR71A106KE22L; Wattage: NA; Project: VOCERA; Customs_HS_Code: 85322990; Custom_Duty: 15%; Value: 10uF; PCB Footprint: CAP0805_1-5; Footprint Path: Y:\MIS_DATABASE\Library\ALTIUM_TOOL\PCB_FOOTPRINTS\Altium_Footprint_Lib.PcbLib; Library Path: Y:\MIS_DATABASE\Library\ALTIUM_TOOL\SCHEMATICS_PARTS\MS_DISCRETE_Library.schlib; MECHANICAL 3D STEP FILE: CAP0805_1-5; Footprint Ref: CAP0805_1-5; Tolerance: 10%; Distributor_name: DIGIKEY; Distributor_part_number: 490-3886-1-ND; Library Ref: CAP; Height: 1.35MM; Weight: 9.5mg; Temperature: -55°C+85°C; Datasheet: Y:\MIS_DATABASE\DATASHEETS\CAPACITORS\MURATA-GXX-SER_NOV17.PDF; Crtd /date: MAZHAR/150506; Chkd/date: SHREESHAIL/220506; Automotive Alternate_mfr_name: MURATA; Manufacturer: MURATA
C768 = CAP_Dup1: CAP CERAMIC 2.2uF 6.3V 10% X7R AUTO 0603; Part Reference: C768; Automotive Alternate_mfr_part_number: CGA3E1X7R0J225K080AC; Automotive Alternate_mfr_name: TDK; Mistral Part No: 120019040009-R; Mfr_name: MURATA; Mfr_part_number: GCM188R70J225KE22D; Part_type: CAPACITORS\CERAMIC; Project: J7ES_SOM_DUAL-LEO_PMIC; Wattage: NA; Customs_HS_Code: 85322990; Custom_Duty: 15%; Value: 2.2uF; Direct Alternate_mfr_part_number: CGA3E1X7R0J225K080AC; Direct Alternate_mfr_name: TDK; Footprint Ref: CAP0603_1; Tolerance: 10%; Distributor_name: DIGIKEY; Distributor_part_number: 490-5316-1-ND; Library Ref: CAP; Height: 0.90MM; Weight: 6.3mg; Temperature: -55°C+125°C; Datasheet: Y:\MIS_DATABASE\DATASHEETS\CAPACITORS\GCM188R70J225KE22.PDF; Crtd /date: ALVY/050419; Chkd/date: MANIRAJA/050419; MECHANICAL 3D STEP FILE: CAP0603_1; Library Path: Y:\MIS_DATABASE\Library\ALTIUM_TOOL\SCHEMATICS_PARTS\MS_DISCRETE_Library.schlib; Footprint Path: Y:\MIS_DATABASE\Library\ALTIUM_TOOL\PCB_FOOTPRINTS\Altium_Footprint_Lib.PcbLib; PCB Footprint: CAP0603_1; Manufacturer: MURATA
C769 = CAP_Dup1: CAP CERAMIC 0.1uF 16V 10% X7R AUTO 0402; Part Reference: C769; Manufacturer: MURATA; Automotive Alternate_mfr_part_number: CGA2B1X7R1C104K050BC; Automotive Alternate_mfr_name: TDK; Direct Alternate_mfr_part_number: GCM155R71C104JA55D; Mistral Part No: 120016070006-R; Mfr_part_number: GCM155R71C104KA55D; Part_type: CAPACITORS\CERAMIC; Project: DCMIST_FPGA_CARD; Wattage: NA; Customs_HS_Code: 85322990; Custom_Duty: 15%; Value: 0.1uF; PCB Footprint: CAP0402_0-75; Direct Alternate_mfr_name: MURATA; Footprint Ref: CAP0402_0-75; Mfr_name: MURATA; Tolerance: 10%; Distributor_name: DIGIKEY; Distributor_part_number: 490-4759-1-ND; Library Ref: CAP; Height: 0.55MM; Weight: 6mg; Temperature: -55°C+125°C; Datasheet: Y:\MIS_DATABASE\DATASHEETS\CAPACITORS\MURATA-GCM-SER.PDF; Crtd /date: VASANTHA/300514; Chkd/date: NAVEED/021014; MECHANICAL 3D STEP FILE: CAP0402_0-75; Library Path: Y:\MIS_DATABASE\Library\ALTIUM_TOOL\SCHEMATICS_PARTS\MS_DISCRETE_Library.schlib; Footprint Path: Y:\MIS_DATABASE\Library\ALTIUM_TOOL\PCB_FOOTPRINTS\Altium_Footprint_Lib.PcbLib
C770 = CAP_Dup1: CAP CERAMIC 2.2uF 6.3V 10% X7R AUTO 0603; Part Reference: C770; Mistral Part No: 120019040009-R; Mfr_name: MURATA; Mfr_part_number: GCM188R70J225KE22D; Part_type: CAPACITORS\CERAMIC; Direct Alternate_mfr_name: TDK; Direct Alternate_mfr_part_number: CGA3E1X7R0J225K080AC; Project: J7ES_SOM_DUAL-LEO_PMIC; Wattage: NA; Customs_HS_Code: 85322990; Custom_Duty: 15%; Value: 2.2uF; Footprint Ref: CAP0603_1; Tolerance: 10%; Distributor_name: DIGIKEY; Distributor_part_number: 490-5316-1-ND; Library Ref: CAP; Height: 0.90MM; Weight: 6.3mg; Temperature: -55°C+125°C; Datasheet: Y:\MIS_DATABASE\DATASHEETS\CAPACITORS\GCM188R70J225KE22.PDF; Crtd /date: ALVY/050419; Chkd/date: MANIRAJA/050419; MECHANICAL 3D STEP FILE: CAP0603_1; Library Path: Y:\MIS_DATABASE\Library\ALTIUM_TOOL\SCHEMATICS_PARTS\MS_DISCRETE_Library.schlib; Footprint Path: Y:\MIS_DATABASE\Library\ALTIUM_TOOL\PCB_FOOTPRINTS\Altium_Footprint_Lib.PcbLib; Automotive Alternate_mfr_name: TDK; Automotive Alternate_mfr_part_number: CGA3E1X7R0J225K080AC; PCB Footprint: CAP0603_1; Manufacturer: MURATA
C773 = CAP_Dup1: CAP CERAMIC 0.1uF 16V 10% X7R AUTO 0402; Part Reference: C773; Automotive Alternate_mfr_part_number: CGA2B1X7R1C104K050BC; Automotive Alternate_mfr_name: TDK; Direct Alternate_mfr_part_number: GCM155R71C104JA55D; Direct Alternate_mfr_name: MURATA; Part_type: CAPACITORS\CERAMIC; Mfr_part_number: GCM155R71C104KA55D; Mistral Part No: 120016070006-R; Custom_Duty: 15%; Customs_HS_Code: 85322990; Wattage: NA; Project: DCMIST_FPGA_CARD; Value: 0.1uF; Footprint Path: Y:\MIS_DATABASE\Library\ALTIUM_TOOL\PCB_FOOTPRINTS\Altium_Footprint_Lib.PcbLib; Library Path: Y:\MIS_DATABASE\Library\ALTIUM_TOOL\SCHEMATICS_PARTS\MS_DISCRETE_Library.schlib; MECHANICAL 3D STEP FILE: CAP0402_0-75; Chkd/date: NAVEED/021014; Crtd /date: VASANTHA/300514; Datasheet: Y:\MIS_DATABASE\DATASHEETS\CAPACITORS\MURATA-GCM-SER.PDF; Temperature: -55°C+125°C; Weight: 6mg; Height: 0.55MM; Library Ref: CAP; Distributor_part_number: 490-4759-1-ND; Distributor_name: DIGIKEY; Tolerance: 10%; Mfr_name: MURATA; Footprint Ref: CAP0402_0-75; PCB Footprint: CAP0402_0-75; Manufacturer: MURATA
C777 = CAP_Dup1: CAP CERAMIC 9pF 50V 0.5pF% C0G(NP0) AUTO 0402; Part Reference: C777; Part_type: CAPACITORS\CERAMIC; Mfr_part_number: CGA2B2NP01H090D050BA; Mfr_name: TDK CORPORATION; Mistral Part No: 120019040066-R; Direct Alternate_mfr_name: TDK; Direct Alternate_mfr_part_number: CGA2B2C0G1H090D050BA; Custom_Duty: 15%; Customs_HS_Code: 85322990; Wattage: NA; Project: J7ES_SOM_DUAL-LEO_PMIC; Value: 9pF; Footprint Path: Y:\MIS_DATABASE\Library\ALTIUM_TOOL\PCB_FOOTPRINTS\Altium_Footprint_Lib.PcbLib; Library Path: Y:\MIS_DATABASE\Library\ALTIUM_TOOL\SCHEMATICS_PARTS\MS_DISCRETE_Library.schlib; Footprint Ref: CAP0402_0-75; MECHANICAL 3D STEP FILE: CAP0402_0-75; Chkd/date: VASANTHA/090419; Crtd /date: ALVY/090419; Datasheet: Y:\MIS_DATABASE\DATASHEETS\CAPACITORS\CGA2B2NP01H090D050BA.PDF; Temperature: -55°C+150°C; Weight: 0.65mg; Height: 0.55MM; Library Ref: CAP; Distributor_part_number: 445-12155-1-ND; Distributor_name: DIGIKEY; Tolerance: 0.5pF%; Automotive Alternate_mfr_name: TDK; Automotive Alternate_mfr_part_number: CGA2B2C0G1H090D050BA; PCB Footprint: CAP0402_0-75; Manufacturer: TDK CORPORATION
C783 = CAP_Dup1: CAP CERAMIC 10uF 16V 10% X5R 0805; Part Reference: C783; Part_type: CAPACITORS\CERAMIC; Mfr_part_number: GRM21BR61C106KE15L; Mfr_name: MURATA; Mistral Part No: 120009030205-R; Direct Alternate_mfr_name: SAMSUNG; Direct Alternate_mfr_part_number: CL21B106KPQNNNE; Automotive Alternate_mfr_part_number: GCM21BR71A106KE22L; Wattage: NA; Custom_Duty: 15%; Customs_HS_Code: 85322990; Project: VOCERA; Value: 10uF; PCB Footprint: CAP0805_1-5; Footprint Path: Y:\MIS_DATABASE\Library\ALTIUM_TOOL\PCB_FOOTPRINTS\Altium_Footprint_Lib.PcbLib; Library Path: Y:\MIS_DATABASE\Library\ALTIUM_TOOL\SCHEMATICS_PARTS\MS_DISCRETE_Library.schlib; MECHANICAL 3D STEP FILE: CAP0805_1-5; Footprint Ref: CAP0805_1-5; Chkd/date: SHREESHAIL/220506; Crtd /date: MAZHAR/150506; Datasheet: Y:\MIS_DATABASE\DATASHEETS\CAPACITORS\MURATA-GXX-SER_NOV17.PDF; Temperature: -55°C+85°C; Weight: 9.5mg; Height: 1.35MM; Library Ref: CAP; Distributor_part_number: 490-3886-1-ND; Distributor_name: DIGIKEY; Tolerance: 10%; Automotive Alternate_mfr_name: MURATA; Manufacturer: MURATA
C784 = CAP_Dup1: CAP CERAMIC 10uF 16V 10% X5R 0805; Part Reference: C784; Mistral Part No: 120009030205-R; Mfr_name: MURATA; Mfr_part_number: GRM21BR61C106KE15L; Part_type: CAPACITORS\CERAMIC; Direct Alternate_mfr_name: SAMSUNG; Direct Alternate_mfr_part_number: CL21B106KPQNNNE; Automotive Alternate_mfr_part_number: GCM21BR71A106KE22L; Wattage: NA; Project: VOCERA; Customs_HS_Code: 85322990; Custom_Duty: 15%; Value: 10uF; PCB Footprint: CAP0805_1-5; Footprint Path: Y:\MIS_DATABASE\Library\ALTIUM_TOOL\PCB_FOOTPRINTS\Altium_Footprint_Lib.PcbLib; Library Path: Y:\MIS_DATABASE\Library\ALTIUM_TOOL\SCHEMATICS_PARTS\MS_DISCRETE_Library.schlib; MECHANICAL 3D STEP FILE: CAP0805_1-5; Footprint Ref: CAP0805_1-5; Tolerance: 10%; Distributor_name: DIGIKEY; Distributor_part_number: 490-3886-1-ND; Library Ref: CAP; Height: 1.35MM; Weight: 9.5mg; Temperature: -55°C+85°C; Datasheet: Y:\MIS_DATABASE\DATASHEETS\CAPACITORS\MURATA-GXX-SER_NOV17.PDF; Crtd /date: MAZHAR/150506; Chkd/date: SHREESHAIL/220506; Automotive Alternate_mfr_name: MURATA; Manufacturer: MURATA
C785 = CAP_Dup1: CAP CERAMIC 9pF 50V 0.5pF% C0G(NP0) AUTO 0402; Part Reference: C785; Part_type: CAPACITORS\CERAMIC; Mfr_part_number: CGA2B2NP01H090D050BA; Mfr_name: TDK CORPORATION; Mistral Part No: 120019040066-R; Direct Alternate_mfr_name: TDK; Direct Alternate_mfr_part_number: CGA2B2C0G1H090D050BA; Custom_Duty: 15%; Customs_HS_Code: 85322990; Wattage: NA; Project: J7ES_SOM_DUAL-LEO_PMIC; Value: 9pF; Footprint Path: Y:\MIS_DATABASE\Library\ALTIUM_TOOL\PCB_FOOTPRINTS\Altium_Footprint_Lib.PcbLib; Library Path: Y:\MIS_DATABASE\Library\ALTIUM_TOOL\SCHEMATICS_PARTS\MS_DISCRETE_Library.schlib; Footprint Ref: CAP0402_0-75; MECHANICAL 3D STEP FILE: CAP0402_0-75; Chkd/date: VASANTHA/090419; Crtd /date: ALVY/090419; Datasheet: Y:\MIS_DATABASE\DATASHEETS\CAPACITORS\CGA2B2NP01H090D050BA.PDF; Temperature: -55°C+150°C; Weight: 0.65mg; Height: 0.55MM; Library Ref: CAP; Distributor_part_number: 445-12155-1-ND; Distributor_name: DIGIKEY; Tolerance: 0.5pF%; Automotive Alternate_mfr_name: TDK; Automotive Alternate_mfr_part_number: CGA2B2C0G1H090D050BA; PCB Footprint: CAP0402_0-75; Manufacturer: TDK CORPORATION
C790 = CAP_Dup1: CAP CERAMIC 47uF 6.3V 10% X7R AUTO 1210; Part Reference: C790; Mistral Part No: 120018090056-R; Mfr_name: MURATA; Mfr_part_number: GCM32ER70J476KE19L; Part_type: CAPACITORS\CERAMIC; Direct Alternate_mfr_name: TDK; Direct Alternate_mfr_part_number: CGA6P1X7S1A476M; Project: TI_J7_SVB-DUT; Wattage: NA; Customs_HS_Code: 85322990; Custom_Duty: 15%; Value: 47uF; Footprint Ref: CAP1210_2-75; Tolerance: 10%; Distributor_name: DIGIKEY; Distributor_part_number: 490-4844-1-ND; Library Ref: CAP; Height: 2.70MM; Weight: 110mg; Temperature: -55°C+125°C; Datasheet: Y:\MIS_DATABASE\DATASHEETS\CAPACITORS\MURATA-GCM-SER.PDF; Crtd /date: ALVY/280918; Chkd/date: MANIRAJA/280918; MECHANICAL 3D STEP FILE: CAP1210_2-75; Library Path: Y:\MIS_DATABASE\Library\ALTIUM_TOOL\SCHEMATICS_PARTS\MS_DISCRETE_Library.schlib; Footprint Path: Y:\MIS_DATABASE\Library\ALTIUM_TOOL\PCB_FOOTPRINTS\Altium_Footprint_Lib.PcbLib; Automotive Alternate_mfr_name: TDK; Automotive Alternate_mfr_part_number: CGA6P1X7S1A476M; PCB Footprint: CAP1210_2-75; Manufacturer: MURATA
C791 = CAP_Dup1: CAP CERAMIC 47uF 6.3V 10% X7R AUTO 1210; Part Reference: C791; Mistral Part No: 120018090056-R; Mfr_name: MURATA; Mfr_part_number: GCM32ER70J476KE19L; Part_type: CAPACITORS\CERAMIC; Direct Alternate_mfr_name: TDK; Direct Alternate_mfr_part_number: CGA6P1X7S1A476M; Project: TI_J7_SVB-DUT; Wattage: NA; Customs_HS_Code: 85322990; Custom_Duty: 15%; Value: 47uF; Footprint Ref: CAP1210_2-75; Tolerance: 10%; Distributor_name: DIGIKEY; Distributor_part_number: 490-4844-1-ND; Library Ref: CAP; Height: 2.70MM; Weight: 110mg; Temperature: -55°C+125°C; Datasheet: Y:\MIS_DATABASE\DATASHEETS\CAPACITORS\MURATA-GCM-SER.PDF; Crtd /date: ALVY/280918; Chkd/date: MANIRAJA/280918; MECHANICAL 3D STEP FILE: CAP1210_2-75; Library Path: Y:\MIS_DATABASE\Library\ALTIUM_TOOL\SCHEMATICS_PARTS\MS_DISCRETE_Library.schlib; Footprint Path: Y:\MIS_DATABASE\Library\ALTIUM_TOOL\PCB_FOOTPRINTS\Altium_Footprint_Lib.PcbLib; Automotive Alternate_mfr_name: TDK; Automotive Alternate_mfr_part_number: CGA6P1X7S1A476M; PCB Footprint: CAP1210_2-75; Manufacturer: MURATA
FL71 = CAP_NFM_TI: PASSIVE FILTER EMI 1uF 4V AUTO 0402; Part Reference: FL71; Mfr_part_number: NFM15HC105D0G_TI; Mfr_name: MURATA; Mistral Part No: 130018100050; Custom_Duty: 15%; Customs_HS_Code: 85412900; Wattage: NA; Project: TI_J7ES_EVM_SOM; Value: 1uF; PCB Footprint: EMIFIL_NFM15CC_0402_0-5_TI; Footprint Path: Y:\MIS_DATABASE\Library\ALTIUM_TOOL\PCB_FOOTPRINTS\Altium_Footprint_Lib.PcbLib; Library Path: Y:\MIS_DATABASE\Library\ALTIUM_TOOL\SCHEMATICS_PARTS\MS_FILTER_Library.schlib; MECHANICAL 3D STEP FILE: EMIFIL_NFM15CC_0402_0-5_TI; RoHS: NA; Chkd/date: MANIRAJA/251018; Crtd /date: ALVY/251018; Datasheet: Y:\MIS_DATABASE\DATASHEETS\DISCRETES\INDUCTORS\NFM15CC223C1A3.PDF; Temperature: NA; Weight: NA; Height: 0.50MM; Library Ref: CAP_NFM_TI; Distributor_part_number: NA; Distributor_name: NA; Package: 0402; Voltage: 4V; Tolerance: NA; Part_type: FILTER; Footprint Ref: EMIFIL_NFM15CC_0402_0-5_TI
FL72 = CAP_NFM_TI: PASSIVE FILTER EMI 1uF 4V AUTO 0402; Part Reference: FL72; Mfr_part_number: NFM15HC105D0G_TI; Mfr_name: MURATA; Mistral Part No: 130018100050; Custom_Duty: 15%; Customs_HS_Code: 85412900; Wattage: NA; Project: TI_J7ES_EVM_SOM; Value: 1uF; PCB Footprint: EMIFIL_NFM15CC_0402_0-5_TI; Footprint Path: Y:\MIS_DATABASE\Library\ALTIUM_TOOL\PCB_FOOTPRINTS\Altium_Footprint_Lib.PcbLib; Library Path: Y:\MIS_DATABASE\Library\ALTIUM_TOOL\SCHEMATICS_PARTS\MS_FILTER_Library.schlib; MECHANICAL 3D STEP FILE: EMIFIL_NFM15CC_0402_0-5_TI; RoHS: NA; Chkd/date: MANIRAJA/251018; Crtd /date: ALVY/251018; Datasheet: Y:\MIS_DATABASE\DATASHEETS\DISCRETES\INDUCTORS\NFM15CC223C1A3.PDF; Temperature: NA; Weight: NA; Height: 0.50MM; Library Ref: CAP_NFM_TI; Distributor_part_number: NA; Distributor_name: NA; Package: 0402; Voltage: 4V; Tolerance: NA; Part_type: FILTER; Footprint Ref: EMIFIL_NFM15CC_0402_0-5_TI
FL76 = CAP_NFM_TI: PASSIVE FILTER EMI 1uF 4V AUTO 0402; Part Reference: FL76; Mistral Part No: 130018100050; Mfr_name: MURATA; Mfr_part_number: NFM15HC105D0G_TI; Project: TI_J7ES_EVM_SOM; Tolerance: NA; Customs_HS_Code: 85412900; Custom_Duty: 15%; Value: 1uF; PCB Footprint: EMIFIL_NFM15CC_0402_0-5_TI; Footprint Ref: EMIFIL_NFM15CC_0402_0-5_TI; Part_type: FILTER; Voltage: 4V; Wattage: NA; Package: 0402; Distributor_name: NA; Distributor_part_number: NA; Library Ref: CAP_NFM_TI; Height: 0.50MM; Weight: NA; Temperature: NA; Datasheet: Y:\MIS_DATABASE\DATASHEETS\DISCRETES\INDUCTORS\NFM15CC223C1A3.PDF; Crtd /date: ALVY/251018; Chkd/date: MANIRAJA/251018; RoHS: NA; MECHANICAL 3D STEP FILE: EMIFIL_NFM15CC_0402_0-5_TI; Library Path: Y:\MIS_DATABASE\Library\ALTIUM_TOOL\SCHEMATICS_PARTS\MS_FILTER_Library.schlib; Footprint Path: Y:\MIS_DATABASE\Library\ALTIUM_TOOL\PCB_FOOTPRINTS\Altium_Footprint_Lib.PcbLib
FL77 = CAP_NFM_TI: PASSIVE FILTER EMI 1uF 4V AUTO 0402; Part Reference: FL77; Mistral Part No: 130018100050; Mfr_name: MURATA; Mfr_part_number: NFM15HC105D0G_TI; Project: TI_J7ES_EVM_SOM; Tolerance: NA; Customs_HS_Code: 85412900; Custom_Duty: 15%; Value: 1uF; PCB Footprint: EMIFIL_NFM15CC_0402_0-5_TI; Footprint Ref: EMIFIL_NFM15CC_0402_0-5_TI; Part_type: FILTER; Voltage: 4V; Wattage: NA; Package: 0402; Distributor_name: NA; Distributor_part_number: NA; Library Ref: CAP_NFM_TI; Height: 0.50MM; Weight: NA; Temperature: NA; Datasheet: Y:\MIS_DATABASE\DATASHEETS\DISCRETES\INDUCTORS\NFM15CC223C1A3.PDF; Crtd /date: ALVY/251018; Chkd/date: MANIRAJA/251018; RoHS: NA; MECHANICAL 3D STEP FILE: EMIFIL_NFM15CC_0402_0-5_TI; Library Path: Y:\MIS_DATABASE\Library\ALTIUM_TOOL\SCHEMATICS_PARTS\MS_FILTER_Library.schlib; Footprint Path: Y:\MIS_DATABASE\Library\ALTIUM_TOOL\PCB_FOOTPRINTS\Altium_Footprint_Lib.PcbLib
L20 = INDUCTOR: IND POWER 0.22uH 6.7A 20% AUTO 1008; Part Reference: L20; Manufacturer: TDK CORPORATION; Mistral Part No: 130020060001-R; Project: J7VCL_SOM_LEO_HERA PMIC BRD; Voltage: NA; Customs_HS_Code: 85437099; Custom_Duty: 24%; Value: 0.22uH; PCB Footprint: IND1008_1-2; Footprint Ref: IND1008_1-2; Mfr_name: TDK CORPORATION; Part_type: INDUCTOR; Tolerance: 20%; Wattage: NA; Package: 1008; Distributor_name: DIGIKEY; Distributor_part_number: 445-181487-1-ND; Library Ref: INDUCTOR; Height: 1.20MM; Weight: 35mg; Temperature: -55°C+150°C; Datasheet: Y:\MIS_DATABASE\DATASHEETS\DISCRETES\INDUCTORS\TFM252012ALMA-SER.PDF; Crtd /date: ALVY/290520; Chkd/date: MANIRAJA/010620; MECHANICAL 3D STEP FILE: IND1008_1-2; Library Path: Y:\MIS_DATABASE\Library\ALTIUM_TOOL\SCHEMATICS_PARTS\MS_DISCRETE_Library.schlib; Footprint Path: Y:\MIS_DATABASE\Library\ALTIUM_TOOL\PCB_FOOTPRINTS\Altium_Footprint_Lib.PcbLib
L21 = INDUCTOR: IND POWER 0.22uH 6.7A 20% AUTO 1008; Part Reference: L21; Manufacturer: TDK CORPORATION; Mistral Part No: 130020060001-R; Project: J7VCL_SOM_LEO_HERA PMIC BRD; Voltage: NA; Customs_HS_Code: 85437099; Custom_Duty: 24%; Value: 0.22uH; PCB Footprint: IND1008_1-2; Footprint Ref: IND1008_1-2; Mfr_name: TDK CORPORATION; Part_type: INDUCTOR; Tolerance: 20%; Wattage: NA; Package: 1008; Distributor_name: DIGIKEY; Distributor_part_number: 445-181487-1-ND; Library Ref: INDUCTOR; Height: 1.20MM; Weight: 35mg; Temperature: -55°C+150°C; Datasheet: Y:\MIS_DATABASE\DATASHEETS\DISCRETES\INDUCTORS\TFM252012ALMA-SER.PDF; Crtd /date: ALVY/290520; Chkd/date: MANIRAJA/010620; MECHANICAL 3D STEP FILE: IND1008_1-2; Library Path: Y:\MIS_DATABASE\Library\ALTIUM_TOOL\SCHEMATICS_PARTS\MS_DISCRETE_Library.schlib; Footprint Path: Y:\MIS_DATABASE\Library\ALTIUM_TOOL\PCB_FOOTPRINTS\Altium_Footprint_Lib.PcbLib
L22 = INDUCTOR: IND POWER 0.22uH 6.7A 20% AUTO 1008; Part Reference: L22; Mfr_name: TDK CORPORATION; Mistral Part No: 130020060001-R; Custom_Duty: 24%; Customs_HS_Code: 85437099; Wattage: NA; Project: J7VCL_SOM_LEO_HERA PMIC BRD; Value: 0.22uH; PCB Footprint: IND1008_1-2; Footprint Path: Y:\MIS_DATABASE\Library\ALTIUM_TOOL\PCB_FOOTPRINTS\Altium_Footprint_Lib.PcbLib; Library Path: Y:\MIS_DATABASE\Library\ALTIUM_TOOL\SCHEMATICS_PARTS\MS_DISCRETE_Library.schlib; MECHANICAL 3D STEP FILE: IND1008_1-2; Chkd/date: MANIRAJA/010620; Crtd /date: ALVY/290520; Datasheet: Y:\MIS_DATABASE\DATASHEETS\DISCRETES\INDUCTORS\TFM252012ALMA-SER.PDF; Temperature: -55°C+150°C; Weight: 35mg; Height: 1.20MM; Library Ref: INDUCTOR; Distributor_part_number: 445-181487-1-ND; Distributor_name: DIGIKEY; Package: 1008; Voltage: NA; Tolerance: 20%; Part_type: INDUCTOR; Footprint Ref: IND1008_1-2; Manufacturer: TDK CORPORATION
L24 = INDUCTOR: IND POWER 0.22uH 6.7A 20% AUTO 1008; Part Reference: L24; Mistral Part No: 130020060001-R; Mfr_name: TDK CORPORATION; Project: J7VCL_SOM_LEO_HERA PMIC BRD; Voltage: NA; Customs_HS_Code: 85437099; Custom_Duty: 24%; Value: 0.22uH; PCB Footprint: IND1008_1-2; Footprint Ref: IND1008_1-2; Part_type: INDUCTOR; Tolerance: 20%; Wattage: NA; Package: 1008; Distributor_name: DIGIKEY; Distributor_part_number: 445-181487-1-ND; Library Ref: INDUCTOR; Height: 1.20MM; Weight: 35mg; Temperature: -55°C+150°C; Datasheet: Y:\MIS_DATABASE\DATASHEETS\DISCRETES\INDUCTORS\TFM252012ALMA-SER.PDF; Crtd /date: ALVY/290520; Chkd/date: MANIRAJA/010620; MECHANICAL 3D STEP FILE: IND1008_1-2; Library Path: Y:\MIS_DATABASE\Library\ALTIUM_TOOL\SCHEMATICS_PARTS\MS_DISCRETE_Library.schlib; Footprint Path: Y:\MIS_DATABASE\Library\ALTIUM_TOOL\PCB_FOOTPRINTS\Altium_Footprint_Lib.PcbLib; Manufacturer: TDK CORPORATION
L25 = INDUCTOR: IND POWER 0.22uH 6.7A 20% AUTO 1008; Part Reference: L25; Mfr_name: TDK CORPORATION; Mistral Part No: 130020060001-R; Custom_Duty: 24%; Customs_HS_Code: 85437099; Wattage: NA; Project: J7VCL_SOM_LEO_HERA PMIC BRD; Value: 0.22uH; PCB Footprint: IND1008_1-2; Footprint Path: Y:\MIS_DATABASE\Library\ALTIUM_TOOL\PCB_FOOTPRINTS\Altium_Footprint_Lib.PcbLib; Library Path: Y:\MIS_DATABASE\Library\ALTIUM_TOOL\SCHEMATICS_PARTS\MS_DISCRETE_Library.schlib; MECHANICAL 3D STEP FILE: IND1008_1-2; Chkd/date: MANIRAJA/010620; Crtd /date: ALVY/290520; Datasheet: Y:\MIS_DATABASE\DATASHEETS\DISCRETES\INDUCTORS\TFM252012ALMA-SER.PDF; Temperature: -55°C+150°C; Weight: 35mg; Height: 1.20MM; Library Ref: INDUCTOR; Distributor_part_number: 445-181487-1-ND; Distributor_name: DIGIKEY; Package: 1008; Voltage: NA; Tolerance: 20%; Part_type: INDUCTOR; Footprint Ref: IND1008_1-2; Manufacturer: TDK CORPORATION
R212 = RESISTOR_Dup2: RES 10K 1/16W 1% 0402; Part Reference: R212; Manufacturer: YAGEO AMERICA; Part_type: RESISTORS\FIXED; Mfr_part_number: RC0402FR-0710KL; Mistral Part No: 110015090015-R; Custom_Duty: 15%; Customs_HS_Code: 85332119; Voltage: NA; Project: VOCERA; Value: 10K_1%; Footprint Path: Y:\MIS_DATABASE\Library\ALTIUM_TOOL\PCB_FOOTPRINTS\Altium_Footprint_Lib.PcbLib; Library Path: Y:\MIS_DATABASE\Library\ALTIUM_TOOL\SCHEMATICS_PARTS\MS_DISCRETE_Library.schlib; MECHANICAL 3D STEP FILE: RES0402_0-5; Chkd/date: VASANTHA/201216; Crtd /date: GEETHA/290506; Datasheet: Y:\MIS_DATABASE\DATASHEETS\RESISTORS\RCXXXXL-SER_MAR18.PDF; Temperature: -55°C+155°C; Weight: 0.65mg; Height: 0.40MM; Library Ref: RESISTOR; Distributor_part_number: 311-10.0KLRTR-ND; Distributor_name: DIGIKEY; Wattage: 1/16W; Tolerance: 1%; Mfr_name: YAGEO AMERICA; Footprint Ref: RES0402_0-5; PCB Footprint: RES0402_0-5
R213 = RESISTOR_Dup2: RES 0E 1/10W JUMPER 0402; Part Reference: R213; Mistral Part No: 110018030052-R; Mfr_name: PANASONIC-ECG; Mfr_part_number: ERJ-2GE0R00X; Part_type: RESISTORS\FIXED; Project: AEGIS POM; Tolerance: NA; Customs_HS_Code: 85332119; Custom_Duty: 15%; IBISSP_MODLES: VALUE REPEATING 2 TIME; Value: 0E; Library Path: Y:\MIS_DATABASE\Library\ALTIUM_TOOL\SCHEMATICS_PARTS\MS_DISCRETE_Library.schlib; Footprint Ref: RES0402_0-5; Voltage: NA; Wattage: 1/10W; Package: 0402; Distributor_name: DIGIKEY; Distributor_part_number: P0.0JCT-ND; Library Ref: RESISTOR; Height: 0.40MM; Weight: 0.8mg; Temperature: -55°C+155°C; Datasheet: Y:\MIS_DATABASE\DATASHEETS\RESISTORS\PAN-ERJSER_NOV17.PDF; Crtd /date: NAVEED/201014; Chkd/date: VASANTHA/061216; MECHANICAL 3D STEP FILE: RES0402_0-5; Footprint Path: Y:\MIS_DATABASE\Library\ALTIUM_TOOL\PCB_FOOTPRINTS\Altium_Footprint_Lib.PcbLib; Manufacturer: PANASONIC-ECG; PCB Footprint: RES0402_0-5
R235 = RESISTOR_Dup2: RES 0E 1/10W JUMPER 0402; Part Reference: R235; Mistral Part No: 110018030052-R; Mfr_name: PANASONIC-ECG; Mfr_part_number: ERJ-2GE0R00X; Part_type: RESISTORS\FIXED; Project: AEGIS POM; Tolerance: NA; Customs_HS_Code: 85332119; Custom_Duty: 15%; IBISSP_MODLES: VALUE REPEATING 2 TIME; Value: 0E; Library Path: Y:\MIS_DATABASE\Library\ALTIUM_TOOL\SCHEMATICS_PARTS\MS_DISCRETE_Library.schlib; Footprint Ref: RES0402_0-5; Voltage: NA; Wattage: 1/10W; Distributor_name: DIGIKEY; Distributor_part_number: P0.0JCT-ND; Library Ref: RESISTOR; Height: 0.40MM; Weight: 0.8mg; Temperature: -55°C+155°C; Datasheet: Y:\MIS_DATABASE\DATASHEETS\RESISTORS\PAN-ERJSER_NOV17.PDF; Crtd /date: NAVEED/201014; Chkd/date: VASANTHA/061216; MECHANICAL 3D STEP FILE: RES0402_0-5; Footprint Path: Y:\MIS_DATABASE\Library\ALTIUM_TOOL\PCB_FOOTPRINTS\Altium_Footprint_Lib.PcbLib; PCB Footprint: RES0402_0-5; Manufacturer: PANASONIC-ECG
R250 = RESISTOR_Dup2: RES 0E 1/10W JUMPER 0402; Part Reference: R250; Manufacturer: PANASONIC-ECG; Part_type: RESISTORS\FIXED; Mfr_part_number: ERJ-2GE0R00X; Mistral Part No: 110018030052-R; IBISSP_MODLES: VALUE REPEATING 2 TIME; Custom_Duty: 15%; Customs_HS_Code: 85332119; Voltage: NA; Project: AEGIS POM; Value: 0E; PCB Footprint: RES0402_0-5; Footprint Path: Y:\MIS_DATABASE\Library\ALTIUM_TOOL\PCB_FOOTPRINTS\Altium_Footprint_Lib.PcbLib; MECHANICAL 3D STEP FILE: RES0402_0-5; Chkd/date: VASANTHA/061216; Crtd /date: NAVEED/201014; Datasheet: Y:\MIS_DATABASE\DATASHEETS\RESISTORS\PAN-ERJSER_NOV17.PDF; Temperature: -55°C+155°C; Weight: 0.8mg; Height: 0.40MM; Library Ref: RESISTOR; Distributor_part_number: P0.0JCT-ND; Distributor_name: DIGIKEY; Wattage: 1/10W; Tolerance: NA; Mfr_name: PANASONIC-ECG; Footprint Ref: RES0402_0-5; Library Path: Y:\MIS_DATABASE\Library\ALTIUM_TOOL\SCHEMATICS_PARTS\MS_DISCRETE_Library.schlib